# Altium schematic sheet FPGA_FLASH.SchDoc
size A; SheetNumber: 3; SheetTotal: 3
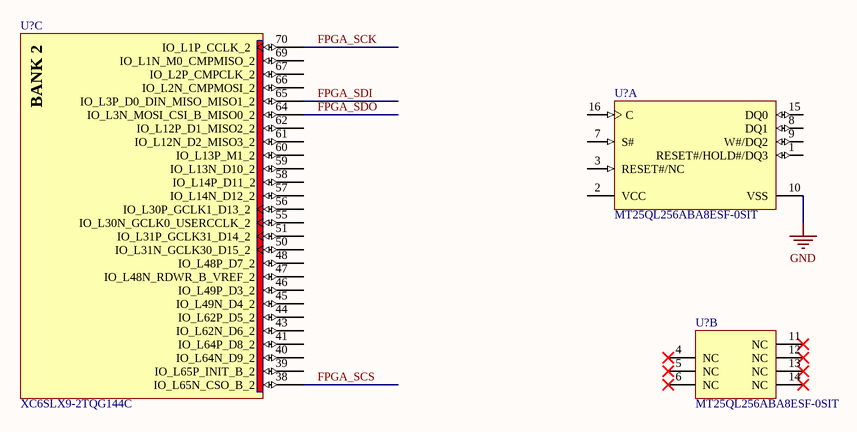
[diagram p0: FPGA_FLASH.SchDoc]

## Parts
(Parts that share a designator on the sheet are numbered #1, #2 ... from top to bottom, then left to right.)
U?#1  XC6SLX9-2TQG144C  [TQG144_N]  (part C of 7)
U?#2  MT25QL256ABA8ESF-0SIT  [MICT-SF-16_L]  (part A of 2)
U?#3  MT25QL256ABA8ESF-0SIT  [MICT-SF-16_L]  (part B of 2)

## Nets
GND: U?#2.10(VSS)
FPGA_SCK: U?#1.70(IO_L1P_CCLK_2)
FPGA_SCS: U?#1.38(IO_L65N_CSO_B_2)
FPGA_SDI: U?#1.65(IO_L3P_D0_DIN_MISO_MISO1_2)
FPGA_SDO: U?#1.64(IO_L3N_MOSI_CSI_B_MISO0_2)

Not connected (* = marked no-connect by the designer): U?#1 39(IO_L65P_INIT_B_2) 40(IO_L64N_D9_2) 41(IO_L64P_D8_2) 43(IO_L62N_D6_2) 44(IO_L62P_D5_2) 45(IO_L49N_D4_2) 46(IO_L49P_D3_2) 47(IO_L48N_RDWR_B_VREF_2) 48(IO_L48P_D7_2) 50(IO_L31N_GCLK30_D15_2) 51(IO_L31P_GCLK31_D14_2) 55(IO_L30N_GCLK0_USERCCLK_2) 56(IO_L30P_GCLK1_D13_2) 57(IO_L14N_D12_2) 58(IO_L14P_D11_2) 59(IO_L13N_D10_2) 60(IO_L13P_M1_2) 61(IO_L12N_D2_MISO3_2) 62(IO_L12P_D1_MISO2_2) 66(IO_L2N_CMPMOSI_2) 67(IO_L2P_CMPCLK_2) 69(IO_L1N_M0_CMPMISO_2); U?#2 1(RESET#/HOLD#/DQ3) 2(VCC) 3(RESET#/NC) 7(S#) 8(DQ1) 9(W#/DQ2) 15(DQ0) 16(C); U?#3 4(NC)* 5(NC)* 6(NC)* 11(NC)* 12(NC)* 13(NC)* 14(NC)*

## Notes on the sheet
- (in symbol CMP-0067-00454-1, part C) BANK 2

## Library data of the parts
U?#1 = CMP-0067-00454-1: Spartan-6 LX 1.2V FPGA, 102 User I/Os, 144-Pin TQFP (0.5mm Pitch), Speed Grade 2, Commercial Grade, Pb-Free; PackageVersion: ver1.2, Jun-2004; DatasheetVersion: ver1.6, Nov-2010; PackageDescription: 144-Pin Thin Quad Flat Pack (TQG144) - Pb-Free; PackageReference: TQG144; Code_JEDEC: MS-026-BFB
U?#2 U?#3 = CMP-2000-07592-1: Micron Serial NOR Flash Memory, 256 Mbits, 2.7 to 3.6 V, -40 to 85 degC, 16-Pin SOP2 (SF), RoHS; Max Supply Voltage: 3.6V; Access Time: 6ns; Density: 256Mb; Operating Supply Voltage: 3.3V; Page Size: 256B; Min Supply Voltage: 2.7V; Min Operating Temperature: -40degC; Max Operating Temperature: 85degC; Manufacturer URL: http://www.micron.com/; Manufacturer: Micron; RoHSCompliant: True; Mounting Technology: SurfaceMount; Datasheet URL: https://www.micron.com/~/media/documents/products/data-sheet/nor-flash/serial-nor/mt25q/die-rev-a/mt25q_qljs_l_256_aba_0.pdf; Datasheet Version: Rev. I, 07/2017; Package Description: 16-Pin Small Outline Integrated Circuit Wide, Body 7.5 X 10.3 mm, Pitch 1.27 mm; Mount: SurfaceMount; Package Reference: SF-16; Memory Type: NOR; Interface: Serial